# EAGLE design AS3364 DG412 bus mixer v1.4 (EAGLE 9.6.2)
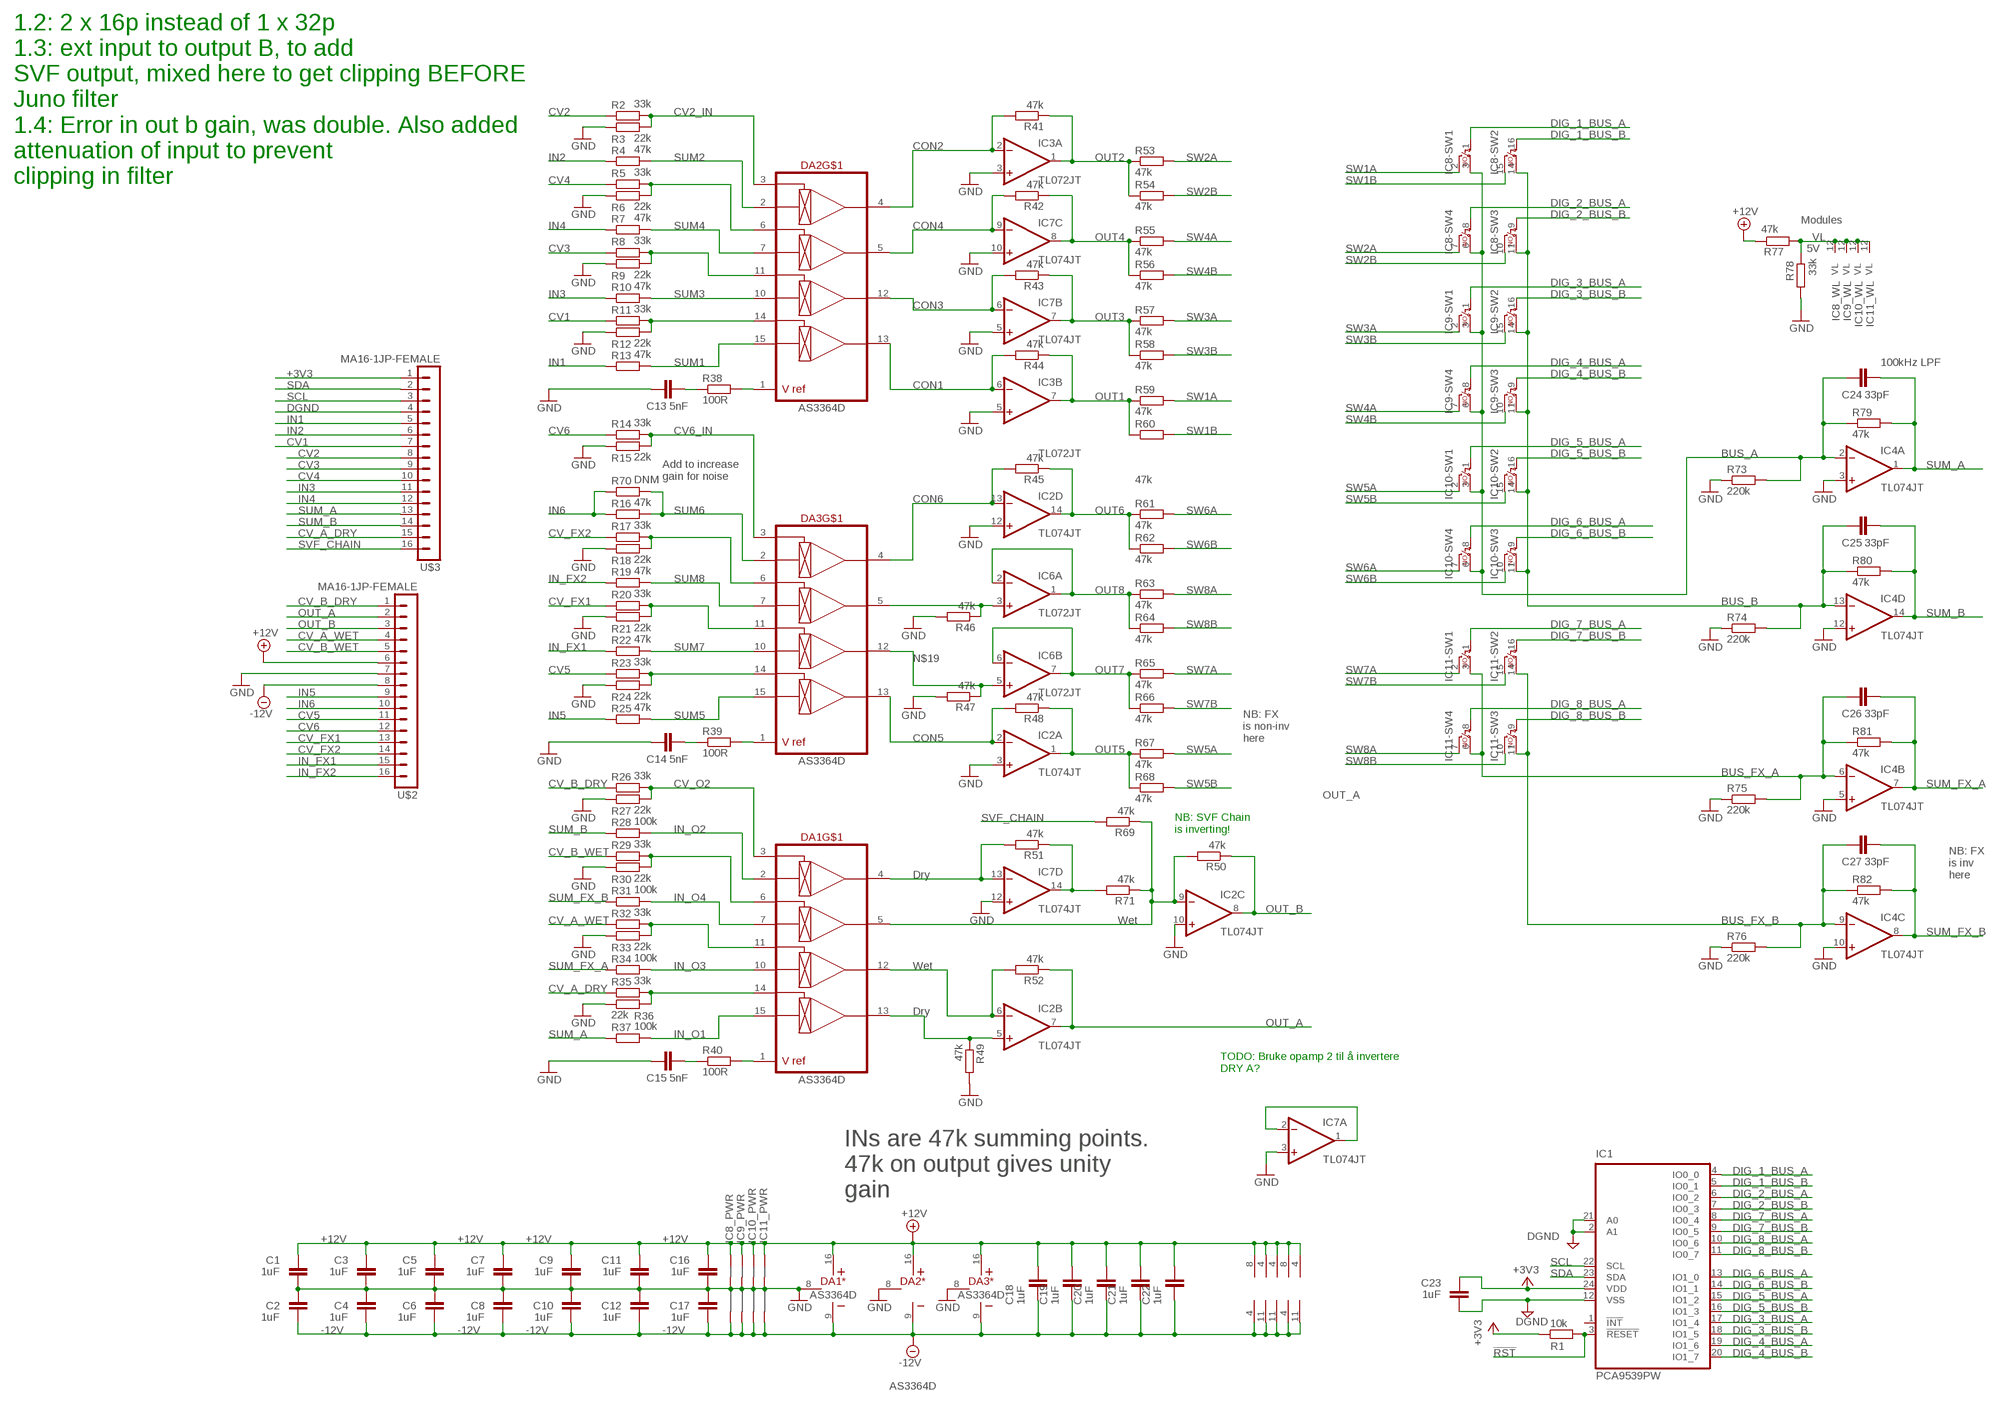
[diagram p0: schematic, sheet 1]

## Parts
C1  1uF  C-EU-J0402  [C0402-J]
C2  1uF  C-EU-J0402  [C0402-J]
C3  1uF  C-EU-J0402  [C0402-J]
C4  1uF  C-EU-J0402  [C0402-J]
C5  1uF  C-EU-J0402  [C0402-J]
C6  1uF  C-EU-J0402  [C0402-J]
C7  1uF  C-EU-J0402  [C0402-J]
C8  1uF  C-EU-J0402  [C0402-J]
C9  1uF  C-EU-J0402  [C0402-J]
C10  1uF  C-EU-J0402  [C0402-J]
C11  1uF  C-EU-J0402  [C0402-J]
C12  1uF  C-EU-J0402  [C0402-J]
C13  5nF  C-EU-J0402  [C0402-J]
C14  5nF  C-EU-J0402  [C0402-J]
C15  5nF  C-EU-J0402  [C0402-J]
C16  1uF  C-EU-J0402  [C0402-J]
C17  1uF  C-EU-J0402  [C0402-J]
C18  1uF  C-EUC0402  [C0402]
C19  1uF  C-EUC0402  [C0402]
C20  1uF  C-EUC0402  [C0402]
C21  1uF  C-EUC0402  [C0402]
C22  1uF  C-EUC0402  [C0402]
C23  1uF  C-EUC0402  [C0402]
C24  33pF  C-EU-J0402  [C0402-J]
C25  33pF  C-EU-J0402  [C0402-J]
C26  33pF  C-EU-J0402  [C0402-J]
C27  33pF  C-EU-J0402  [C0402-J]
DA1  AS3364D  [DIL16J]
DA2  AS3364D  [DIL16J]
DA3  AS3364D  [DIL16J]
IC1  PCA9539PW  [TSSOP24J]
IC2  TL074JT  [TSSOP14J]
IC3  TL072JT  [TSSOP8J]
IC4  TL074JT  [TSSOP14J]
IC6  TL072JT  [TSSOP8J]
IC7  TL074JT  [TSSOP14J]
IC8  DG412-J  [DIL16J]
IC9  DG412-J  [DIL16J]
IC10  DG412-J  [DIL16J]
IC11  DG412-J  [DIL16J]
R1  10k  R-EU_R0402  [R0402]
R2  33k  R-EU_R0402  [R0402]
R3  22k  R-EU_R0402  [R0402]
R4  47k  R-EU_R0402  [R0402]
R5  33k  R-EU_R0402  [R0402]
R6  22k  R-EU_R0402  [R0402]
R7  47k  R-EU_R0402  [R0402]
R8  33k  R-EU_R0402  [R0402]
R9  22k  R-EU_R0402  [R0402]
R10  47k  R-EU_R0402  [R0402]
R11  33k  R-EU_R0402  [R0402]
R12  22k  R-EU_R0402  [R0402]
R13  47k  R-EU_R0402  [R0402]
R14  33k  R-EU_R0402  [R0402]
R15  22k  R-EU_R0402  [R0402]
R16  47k  R-EU_R0402  [R0402]
R17  33k  R-EU_R0402  [R0402]
R18  22k  R-EU_R0402  [R0402]
R19  47k  R-EU_R0402  [R0402]
R20  33k  R-EU_R0402  [R0402]
R21  22k  R-EU_R0402  [R0402]
R22  47k  R-EU_R0402  [R0402]
R23  33k  R-EU_R0402  [R0402]
R24  22k  R-EU_R0402  [R0402]
R25  47k  R-EU_R0402  [R0402]
R26  33k  R-EU_R0402  [R0402]
R27  22k  R-EU_R0402  [R0402]
R28  100k  R-EU_R0402  [R0402]
R29  33k  R-EU_R0402  [R0402]
R30  22k  R-EU_R0402  [R0402]
R31  100k  R-EU_R0402  [R0402]
R32  33k  R-EU_R0402  [R0402]
R33  22k  R-EU_R0402  [R0402]
R34  100k  R-EU_R0402  [R0402]
R35  33k  R-EU_R0402  [R0402]
R36  22k  R-EU_R0402  [R0402]
R37  100k  R-EU_R0402  [R0402]
R38  100R  R-EU_R0402  [R0402]
R39  100R  R-EU_R0402  [R0402]
R40  100R  R-EU_R0402  [R0402]
R41  47k  R-EU_R0402  [R0402]
R42  47k  R-EU_R0402  [R0402]
R43  47k  R-EU_R0402  [R0402]
R44  47k  R-EU_R0402  [R0402]
R45  47k  R-EU_R0402  [R0402]
R46  47k  R-EU_R0402  [R0402]
R47  47k  R-EU_R0402  [R0402]
R48  47k  R-EU_R0402  [R0402]
R49  47k  R-EU_R0402  [R0402]
R50  47k  R-EU_R0402  [R0402]
R51  47k  R-EU_R0402  [R0402]
R52  47k  R-EU_R0402  [R0402]
R53  47k  R-EU_R0402  [R0402]
R54  47k  R-EU_R0402  [R0402]
R55  47k  R-EU_R0402  [R0402]
R56  47k  R-EU_R0402  [R0402]
R57  47k  R-EU_R0402  [R0402]
R58  47k  R-EU_R0402  [R0402]
R59  47k  R-EU_R0402  [R0402]
R60  47k  R-EU_R0402  [R0402]
R61  47k  R-EU_R0402  [R0402]
R62  47k  R-EU_R0402  [R0402]
R63  47k  R-EU_R0402  [R0402]
R64  47k  R-EU_R0402  [R0402]
R65  47k  R-EU_R0402  [R0402]
R66  47k  R-EU_R0402  [R0402]
R67  47k  R-EU_R0402  [R0402]
R68  47k  R-EU_R0402  [R0402]
R69  47k  R-EU_R0402  [R0402]
R70  DNM  R-EU_R0805  [R0805]
R71  47k  R-EU_R0402  [R0402]
R73  220k  R-EU_R0603  [R0603]
R74  220k  R-EU_R0603  [R0603]
R75  220k  R-EU_R0603  [R0603]
R76  220k  R-EU_R0603  [R0603]
R77  47k  R-EU_R0402  [R0402]
R78  33k  R-EU_R0402  [R0402]
R79  47k  R-EU_R0402  [R0402]
R80  47k  R-EU_R0402  [R0402]
R81  47k  R-EU_R0402  [R0402]
R82  47k  R-EU_R0402  [R0402]
U$2  MA16-1JP-FEMALE  MA16-1JP  [SIP-PIN16-1J]
U$3  MA16-1JP-FEMALE  MA16-1JP  [SIP-PIN16-1J]

## Nets
!RST: IC1.3(!RESET) R1.2
+3V3: C23.2 IC1.24(VDD) R1.1 U$3.1
+12V: C1.2 C3.2 C5.2 C7.2 C9.2 C11.2 C16.2 C18.2 C19.2 C20.2 C21.2 C22.2 DA1.16(*:V+) DA2.16(*:V+) DA3.16(*:V+) IC2.4(P:V+) IC3.8(P:V+) IC4.4(P:V+) IC6.8(P:V+) IC7.4(P:V+) IC8.13(_PWR:+15V) IC9.13(_PWR:+15V) IC10.13(_PWR:+15V) IC11.13(_PWR:+15V) R77.1 U$2.6
-12V: C2.1 C4.1 C6.1 C8.1 C10.1 C12.1 C17.1 C18.1 C19.1 C20.1 C21.1 C22.1 DA1.9(*:V-) DA2.9(*:V-) DA3.9(*:V-) IC2.11(P:V-) IC3.4(P:V-) IC4.11(P:V-) IC6.4(P:V-) IC7.11(P:V-) IC8.4(_PWR:-15V) IC9.4(_PWR:-15V) IC10.4(_PWR:-15V) IC11.4(_PWR:-15V) U$2.8
BUS_A: C24.1 IC4.2(A:-IN) IC8.3(-SW1:S) IC8.6(-SW4:S) IC9.3(-SW1:S) IC9.6(-SW4:S) IC10.3(-SW1:S) IC10.6(-SW4:S) R73.2 R79.1
BUS_B: C25.1 IC4.13(D:-IN) IC8.11(-SW3:S) IC8.14(-SW2:S) IC9.11(-SW3:S) IC9.14(-SW2:S) IC10.11(-SW3:S) IC10.14(-SW2:S) R74.2 R80.1
BUS_FX_A: C26.1 IC4.6(B:-IN) IC11.3(-SW1:S) IC11.6(-SW4:S) R75.2 R81.1
BUS_FX_B: C27.1 IC4.9(C:-IN) IC11.11(-SW3:S) IC11.14(-SW2:S) R76.2 R82.1
CON1: DA2.13(OUT4) IC3.6(B:-IN) R44.2
CON2: DA2.4(OUT1) IC3.2(A:-IN) R41.2
CON3: DA2.12(OUT3) IC7.6(B:-IN) R43.2
CON4: DA2.5(OUT2) IC7.9(C:-IN) R42.2
CON5: DA3.13(OUT4) IC2.2(A:-IN) R48.2
CON6: DA3.4(OUT1) IC2.13(D:-IN) R45.2
CON_O1: DA1.12(OUT3) IC2.6(B:-IN) R52.2
CV1: R11.1 U$3.7
CV2: R2.1 U$3.8
CV2_IN: DA2.3(CV1) R2.2 R3.2
CV3: R8.1 U$3.9
CV4: R5.1 U$3.10
CV5: R23.1 U$2.11
CV6: R14.1 U$2.12
CV6_IN: DA3.3(CV1) R14.2 R15.2
CV_A_DRY: R35.1 U$3.15
CV_A_WET: R32.1 U$2.4
CV_B_DRY: R26.1 U$2.1
CV_B_WET: R29.1 U$2.5
CV_FX1: R20.1 U$2.13
CV_FX2: R17.1 U$2.14
CV_O2: DA1.3(CV1) R26.2 R27.2
DGND: C23.1 IC1.2(A1) IC1.12(VSS) IC1.21(A0) U$3.4
DIG_1_BUS_A: IC1.4(IO0_0) IC8.1(-SW1:C)
DIG_1_BUS_B: IC1.5(IO0_1) IC8.16(-SW2:C)
DIG_2_BUS_A: IC1.6(IO0_2) IC8.8(-SW4:C)
DIG_2_BUS_B: IC1.7(IO0_3) IC8.9(-SW3:C)
DIG_3_BUS_A: IC1.17(IO1_4) IC9.1(-SW1:C)
DIG_3_BUS_B: IC1.18(IO1_5) IC9.16(-SW2:C)
DIG_4_BUS_A: IC1.19(IO1_6) IC9.8(-SW4:C)
DIG_4_BUS_B: IC1.20(IO1_7) IC9.9(-SW3:C)
DIG_5_BUS_A: IC1.15(IO1_2) IC10.1(-SW1:C)
DIG_5_BUS_B: IC1.16(IO1_3) IC10.16(-SW2:C)
DIG_6_BUS_A: IC1.13(IO1_0) IC10.8(-SW4:C)
DIG_6_BUS_B: IC1.14(IO1_1) IC10.9(-SW3:C)
DIG_7_BUS_A: IC1.8(IO0_4) IC11.1(-SW1:C)
DIG_7_BUS_B: IC1.9(IO0_5) IC11.16(-SW2:C)
DIG_8_BUS_A: IC1.10(IO0_6) IC11.8(-SW4:C)
DIG_8_BUS_B: IC1.11(IO0_7) IC11.9(-SW3:C)
GND: C1.1 C2.2 C3.1 C4.2 C5.1 C6.2 C7.1 C8.2 C9.1 C10.2 C11.1 C12.2 C13.1 C14.1 C15.1 C16.1 C17.2 DA1.8(*:GND) DA2.8(*:GND) DA3.8(*:GND) IC2.3(A:+IN) IC2.10(C:+IN) IC2.12(D:+IN) IC3.3(A:+IN) IC3.5(B:+IN) IC4.3(A:+IN) IC4.5(B:+IN) IC4.10(C:+IN) IC4.12(D:+IN) IC7.3(A:+IN) IC7.5(B:+IN) IC7.10(C:+IN) IC7.12(D:+IN) IC8.5(_PWR:AGND) IC9.5(_PWR:AGND) IC10.5(_PWR:AGND) IC11.5(_PWR:AGND) R3.1 R6.1 R9.1 R12.1 R15.1 R18.1 R21.1 R24.1 R27.1 R30.1 R33.1 R36.1 R46.2 R47.2 R49.2 R73.1 R74.1 R75.1 R76.1 R78.2 U$2.7
IN1: R13.1 U$3.5
IN2: R4.1 U$3.6
IN3: R10.1 U$3.11
IN4: R7.1 U$3.12
IN5: R25.1 U$2.9
IN6: R16.1 R70.1 U$2.10
IN_FX1: R22.1 U$2.15
IN_FX2: R19.1 U$2.16
IN_O1: DA1.15(IN4) R37.2
IN_O2: DA1.2(IN1) R28.2
IN_O3: DA1.10(IN3) R34.2
IN_O4: DA1.7(IN2) R31.2
N$1: DA3.1(VREF) R39.2
N$2: DA2.1(VREF) R38.2
N$3: DA3.6(CV2) R17.2 R18.2
N$4: DA3.5(OUT2) IC6.3(A:+IN) R46.1
N$5: DA3.11(CV3) R20.2 R21.2
N$6: DA1.5(OUT2) IC2.9(C:-IN) R50.2 R69.1 R71.1
N$7: DA3.14(CV4) R23.2 R24.2
N$8: C14.2 R39.1
N$9: DA1.1(VREF) R40.2
N$10: DA2.6(CV2) R5.2 R6.2
N$11: DA1.6(CV2) R29.2 R30.2
N$12: DA2.11(CV3) R8.2 R9.2
N$13: DA1.11(CV3) R32.2 R33.2
N$14: C13.2 R38.1
N$15: DA1.14(CV4) R35.2 R36.2
N$16: C15.2 R40.1
N$17: DA1.4(OUT1) IC7.13(D:-IN) R51.2
N$18: DA1.13(OUT4) IC2.5(B:+IN) R49.1
N$19: DA3.12(OUT3) IC6.5(B:+IN) R47.1
N$20: IC7.14(D:OUT) R51.1 R71.2
N$21: DA2.14(CV4) R11.2 R12.2
N$22: IC7.1(A:OUT) IC7.2(A:-IN)
OUT1: IC3.7(B:OUT) R44.1 R59.1 R60.1
OUT2: IC3.1(A:OUT) R41.1 R53.1 R54.1
OUT3: IC7.7(B:OUT) R43.1 R57.1 R58.1
OUT4: IC7.8(C:OUT) R42.1 R55.1 R56.1
OUT5: IC2.1(A:OUT) R48.1 R67.1 R68.1
OUT6: IC2.14(D:OUT) R45.1 R61.1 R62.1
OUT7: IC6.6(B:-IN) IC6.7(B:OUT) R65.1 R66.1
OUT8: IC6.1(A:OUT) IC6.2(A:-IN) R63.1 R64.1
OUT_A: IC2.7(B:OUT) R52.1 U$2.2
OUT_B: IC2.8(C:OUT) R50.1 U$2.3
SCL: IC1.22(SCL) U$3.3
SDA: IC1.23(SDA) U$3.2
SUM1: DA2.15(IN4) R13.2
SUM2: DA2.2(IN1) R4.2
SUM3: DA2.10(IN3) R10.2
SUM4: DA2.7(IN2) R7.2
SUM5: DA3.15(IN4) R25.2
SUM6: DA3.2(IN1) R16.2 R70.2
SUM7: DA3.10(IN3) R22.2
SUM8: DA3.7(IN2) R19.2
SUM_A: C24.2 IC4.1(A:OUT) R37.1 R79.2 U$3.13
SUM_B: C25.2 IC4.14(D:OUT) R28.1 R80.2 U$3.14
SUM_FX_A: C26.2 IC4.7(B:OUT) R34.1 R81.2
SUM_FX_B: C27.2 IC4.8(C:OUT) R31.1 R82.2
SVF_CHAIN: R69.2 U$3.16
SW1A: IC8.2(-SW1:D) R59.2
SW1B: IC8.15(-SW2:D) R60.2
SW2A: IC8.7(-SW4:D) R53.2
SW2B: IC8.10(-SW3:D) R54.2
SW3A: IC9.2(-SW1:D) R57.2
SW3B: IC9.15(-SW2:D) R58.2
SW4A: IC9.7(-SW4:D) R55.2
SW4B: IC9.10(-SW3:D) R56.2
SW5A: IC10.2(-SW1:D) R67.2
SW5B: IC10.15(-SW2:D) R68.2
SW6A: IC10.7(-SW4:D) R61.2
SW6B: IC10.10(-SW3:D) R62.2
SW7A: IC11.2(-SW1:D) R65.2
SW7B: IC11.15(-SW2:D) R66.2
SW8A: IC11.7(-SW4:D) R63.2
SW8B: IC11.10(-SW3:D) R64.2
VL: IC8.12(_WL:VL) IC9.12(_WL:VL) IC10.12(_WL:VL) IC11.12(_WL:VL) R77.2 R78.1
Unconnected: IC1.1(!INT)

## Notes on the sheet
- 1.2: 2 x 16p instead of 1 x 32p
  1.3: ext input to output B, to add
  SVF output, mixed here to get clipping BEFORE
  Juno filter
  1.4: Error in out b gain, was double. Also added 
  attenuation of input to prevent 
  clipping in filter
- Modules
- 5V
- 100kHz LPF
- Add to increase
  gain for noise
- NB: FX
  is non-inv
  here
- NB: SVF Chain
  is inverting!
- Dry
- NB: FX
  is inv
  here
- Wet
- Wet
- Dry
- TODO: Bruke opamp 2 til å invertere
  DRY A?
- INs are 47k summing points.
  47k on output gives unity
  gain

## Library data of the parts
C1-C17 C24-C27 = joakim:C-EU-J: CAPACITOR, European symbol
C18-C23 = rcl:C-EU: CAPACITOR, European symbol; SPICEPREFIX: C
DA1-DA3 = joakim:AS3364: AS3364 quad linear VCA, CEM3360 style. CV is 0 to 2V Vcc-Vee = 26V max, so +/-12V or +15V/-9V
IC1 = joakim:PCA9539: 16ch i/o expander. RPW version resets only internal statemachine to get out of stuck i2c-bus, other versions also reset outputs. Interrupt output requires external pull-up resistor for all variants. https://www.nxp.com/docs/en/data-sheet/PCA9539_PCA9539R.pdf
IC2 IC4 IC7 = joakim:TL074J: OP AMP
IC3 IC6 = joakim:TL072J: OP AMP
IC8-IC11 = joakim:DG412-J: Quad switch, normally open
R1-R71 R73-R82 = rcl:R-EU_: RESISTOR, European symbol; SPICEPREFIX: R
U$2 U$3 = joakim:MA16-1J

## Board
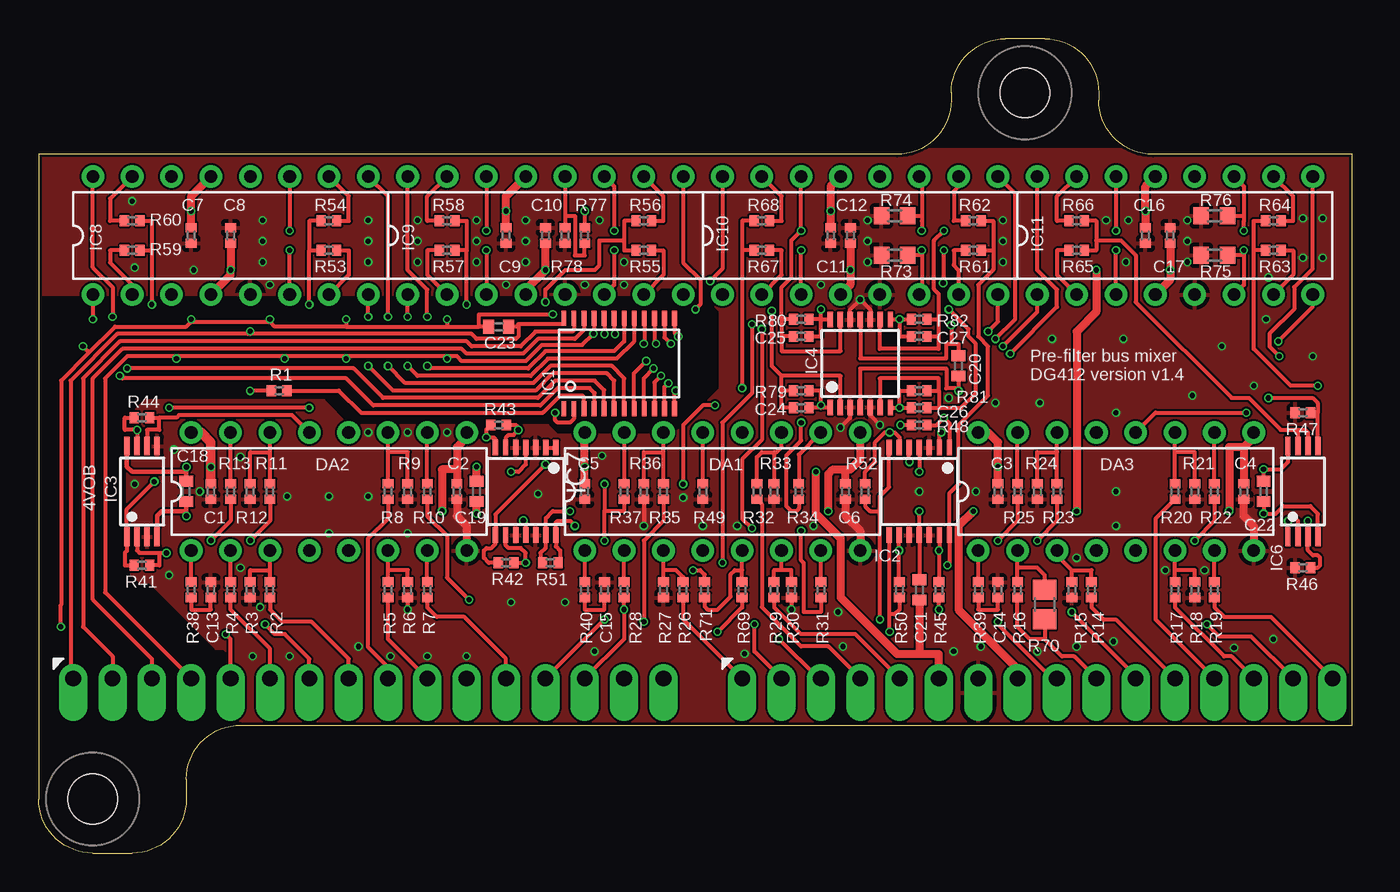
[diagram p1: board, top side]
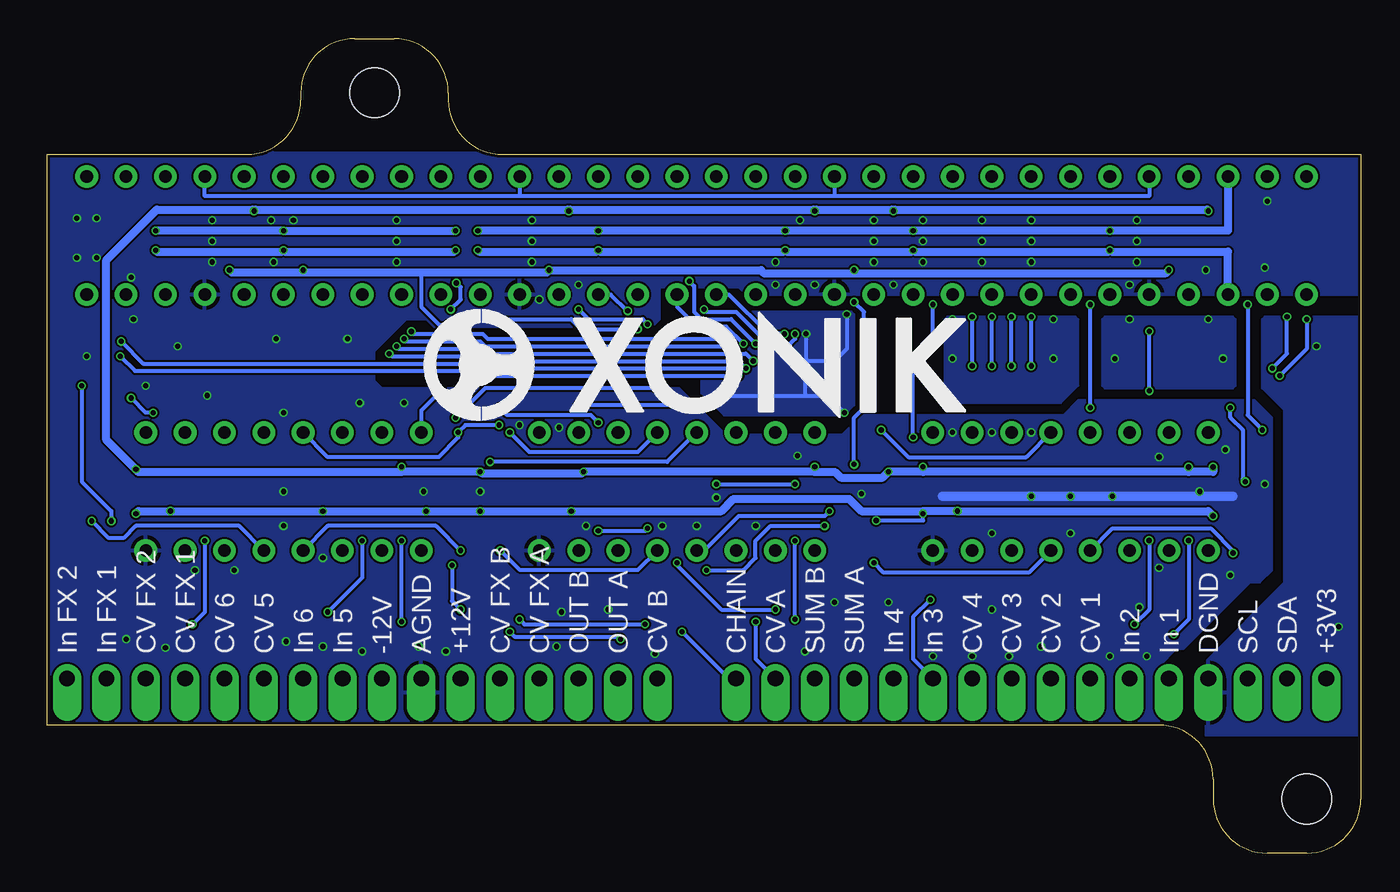
[diagram p2: board, bottom side, seen from below]

Size 84.77 x 52.55 mm. Coordinates in mm from the lower left corner, seen from the top.
Outline: 3.49,0 6.03,0 arc90 9.52,3.49 9.52,4.76 arc-90 13.02,8.26 84.77,8.26 84.77,45.09 71.91,45.09 arc-90 68.42,48.58 68.42,49.05 arc90 64.93,52.55 62.39,52.55 arc90 58.9,49.05 58.9,48.58 arc-90 55.4,45.09 0,45.09 0,3.49 arc90 3.49,0
Copper layers (1*16): Top 0.035mm / dielectric 1.6mm / Bottom 0.035mm
Design rules "jlcpcb-2layers *": minimum track width 5mil, minimum drill 0.3mm, track to track 5mil, track to pad 5mil, pad to pad 5mil, via to via 5mil, smd to smd 5mil, copper to edge 0.2mm, drill to drill 6mil, minimum pad ring 10mil, minimum via ring 4mil, stop-mask expansion 4mil, vias tented up to drill 0mil, thermal gap 10mil
Holes 3.2 mm at 63.66,49.05 3.49,3.49

### Footprints (pad centres in the part's own frame; a part is rotated, then mirrored left to right if it is on the bottom)
C0402-J = smd 0.6 x 0.7: 1 -0.5,0; 2 0.5,0
C0402 = smd 0.7 x 0.9: 1 -0.65,0; 2 0.65,0
DIL16J = drill 0.813: 1 -8.89,-3.81; 2 -6.35,-3.81; 3 -3.81,-3.81; 4 -1.27,-3.81; 5 1.27,-3.81; 6 3.81,-3.81; 7 6.35,-3.81; 8 8.89,-3.81; 9 8.89,3.81; 10 6.35,3.81; 11 3.81,3.81; 12 1.27,3.81; 13 -1.27,3.81; 14 -3.81,3.81; 15 -6.35,3.81; 16 -8.89,3.81
TSSOP24J = smd 0.305 x 0.991: 1 -3.575,-2.918; 2 -2.925,-2.918; 3 -2.275,-2.918; 4 -1.625,-2.918; 5 -0.975,-2.918; 6 -0.325,-2.918; 7 0.325,-2.918; 8 0.975,-2.918; 9 1.625,-2.918; 10 2.275,-2.918; 11 2.925,-2.918; 12 3.575,-2.918; 13 3.575,2.918; 14 2.925,2.918; 15 2.275,2.918; 16 1.625,2.918; 17 0.975,2.918; 18 0.325,2.918; 19 -0.325,2.918; 20 -0.975,2.918; 21 -1.625,2.918; 22 -2.275,2.918; 23 -2.925,2.918; 24 -3.575,2.918
TSSOP14J = smd 0.35 x 1: 1 -1.95,-2.825; 2 -1.3,-2.825; 3 -0.65,-2.825; 4 0,-2.825; 5 0.65,-2.825; 6 1.3,-2.825; 7 1.95,-2.825; 8 1.95,2.825; 9 1.3,2.825; 10 0.65,2.825; 11 0,2.825; 12 -0.65,2.825; 13 -1.3,2.825; 14 -1.95,2.825
TSSOP8J = smd 1.2 x 0.35: 1 -2.925,0.975; 2 -2.925,0.325; 3 -2.925,-0.325; 4 -2.925,-0.975; 5 2.925,-0.975; 6 2.925,-0.325; 7 2.925,0.325; 8 2.925,0.975
R0402 = smd 0.6 x 0.7: 1 -0.5,0; 2 0.5,0
R0805 = smd 1.3 x 1.5: 1 -0.95,0; 2 0.95,0
R0603 = smd 1 x 1.1: 1 -0.85,0; 2 0.85,0
SIP-PIN16-1J = drill 1.016 offset: 1 -19.05,0; 2 -16.51,0; 3 -13.97,0; 4 -11.43,0; 5 -8.89,0; 6 -6.35,0; 7 -3.81,0; 8 -1.27,0; 9 1.27,0; 10 3.81,0; 11 6.35,0; 12 8.89,0; 13 11.43,0; 14 13.97,0; 15 16.51,0; 16 19.05,0

### Placement (x,y rotation side)
C1  11.11,23.34 90 top
C2  26.99,23.34 270 top
C3  61.91,23.34 90 top
C4  77.79,23.34 270 top
C5  35.24,23.34 90 top
C6  52.07,23.34 270 top
C7  9.84,39.85 90 top
C8  12.38,39.85 90 top
C9  30.16,39.85 90 top
C10  32.7,39.85 90 top
C11  51.12,39.85 90 top
C12  52.39,39.85 90 top
C13  11.11,16.99 270 top
C14  61.91,16.99 270 top
C15  36.51,16.99 270 top
C16  71.44,39.85 90 top
C17  73.03,39.85 90 top
C18  9.53,23.34 90 top
C19  28.26,23.34 90 top
C20  59.37,31.43 270 top
C21  56.83,16.99 270 top
C22  79.06,23.34 90 top
C23  29.69,33.97 0 top
C24  49.21,29.84 0 top
C25  49.21,33.34 0 top
C26  56.83,29.84 180 top
C27  56.83,33.34 180 top
DA1  44.13,23.34 0 top
DA2  18.73,23.34 0 top
DA3  69.53,23.34 0 top
IC1  37.47,31.59 0 top
IC2  56.83,23.34 180 top
IC3  6.67,23.34 90 top
IC4  53.02,31.59 0 top
IC6  81.6,23.34 90 top
IC7  31.43,23.34 180 top
IC8  12.38,39.85 0 top
IC9  32.7,39.85 0 top
IC10  53.02,39.85 0 top
IC11  73.34,39.85 0 top
R1  15.53,29.84 0 top
R2  14.92,16.99 90 top
R3  13.65,16.99 90 top
R4  12.38,16.99 90 top
R5  22.54,16.99 90 top
R6  23.81,16.99 90 top
R7  25.08,16.99 90 top
R8  22.54,23.34 90 top
R9  23.81,23.34 90 top
R10  25.08,23.34 90 top
R11  14.92,23.34 90 top
R12  13.65,23.34 90 top
R13  12.38,23.34 90 top
R14  67.95,16.99 90 top
R15  66.67,16.99 90 top
R16  63.18,16.99 90 top
R17  73.34,16.99 90 top
R18  74.61,16.99 90 top
R19  75.88,16.99 90 top
R20  73.34,23.34 90 top
R21  74.61,23.34 90 top
R22  75.88,23.34 90 top
R23  65.72,23.34 90 top
R24  64.45,23.34 90 top
R25  63.18,23.34 90 top
R26  41.59,16.99 90 top
R27  40.32,16.99 90 top
R28  37.78,16.99 90 top
R29  47.47,16.99 90 top
R30  48.58,16.99 90 top
R31  50.48,16.99 90 top
R32  46.36,23.34 90 top
R33  47.47,23.34 90 top
R34  49.05,23.34 90 top
R35  40.32,23.34 90 top
R36  39.05,23.34 90 top
R37  37.78,23.34 90 top
R38  9.84,16.99 90 top
R39  60.64,16.99 90 top
R40  35.24,16.99 90 top
R41  6.67,18.57 0 top
R42  30.16,18.73 0 top
R43  29.69,27.62 0 top
R44  6.67,28.1 0 top
R45  58.1,16.99 90 top
R46  81.6,18.41 180 top
R47  81.6,28.42 180 top
R48  56.83,27.62 180 top
R49  42.86,23.34 270 top
R50  55.56,16.99 90 top
R51  33.02,18.73 180 top
R52  53.34,23.34 90 top
R53  18.73,38.89 0 top
R54  18.73,40.8 0 top
R55  39.05,38.89 0 top
R56  39.05,40.8 0 top
R57  26.35,38.89 180 top
R58  26.35,40.8 180 top
R59  6.03,38.89 180 top
R60  6.03,40.8 180 top
R61  60.33,38.89 180 top
R62  60.33,40.8 180 top
R63  79.69,38.89 0 top
R64  79.69,40.8 0 top
R65  66.99,38.89 180 top
R66  66.99,40.8 180 top
R67  46.67,38.89 0 top
R68  46.67,40.8 0 top
R69  45.4,16.99 270 top
R70  64.93,16.03 90 top
R71  42.98,16.99 90 top
R73  55.24,38.58 0 top
R74  55.24,41.12 0 top
R75  75.88,38.58 0 top
R76  75.88,41.12 0 top
R77  35.24,39.85 270 top
R78  33.97,39.85 270 top
R79  49.21,28.73 0 top
R80  49.21,34.45 0 top
R81  56.83,28.73 180 top
R82  56.83,34.45 180 top
U$1  [XONIK_LOGO_35]  60.48,27.94 0 bottom
U$2  64.45,11.27 0 top
U$3  21.27,11.27 0 top

### Tracks (layer width: path | path; a pad name or v marks a point on that pad's centre or on a via)
!RST
  Top 0.254: IC1.3 35.19,29.42 35.08,29.53 33.66,29.53 32.54,28.42 20.8,28.42 19.37,29.84 R1.2
+3V3  (via drill 0.33)
  Top 0.254: IC1.24 33.89,34.19 33.83,34.13 30.96,34.13 30.96,33.97 | 30.96,33.97 C23.2 | 30.96,33.97 30.96,33.34 30.8,33.18 28.26,33.18 27.94,33.5 13.65,33.5 | 13.65,33.5 13.49,33.5 5.08,33.5 2.06,30.48 2.06,11.43 U$3.1 | 13.65,33.5 13.65,33.66 13.63,33.66 v13.65,33.67 | R1.1 13.67,29.84 v13.65,29.83
  Bottom 0.254: v13.65,29.83 v13.65,33.67
+12V  (via drill 0.33, 0.35)
  Top 0.254: v35.24,41.43 R77.1 | IC4.4 53.02,31.27 58.56,31.27 58.58,31.26 58.58,29.98 59.21,29.98 v59.37,29.83 C20.2 | C22.2 v79.06,24.77 80.17,24.77 80.64,25.24 80.64,26.24 IC6.8 | IC2.4 v56.83,24.61 | C20.2 | 30.46,24.63 v30.48,24.61 30.96,24.61 31.43,25.08 IC7.4
  Top 0.305: IC3.8 5.69,24.95 6.03,24.61 9.52,24.61 | 9.52,24.61 C18.2 | 9.52,24.61 v9.52,24.92
  Top 0.508: C3.2 v61.91,24.92 61.91,26.51 61.28,27.15 DA3.16 | C5.2 v35.24,24.92 DA1.16 | C7.2 v9.84,41.43 9.84,42.39 IC8.13 | C9.2 v30.16,41.43 30.16,42.39 IC9.13 | C11.2 v51.12,41.43 51.12,43.02 IC10.13 | C16.2 v71.44,41.43 71.44,43.02 IC11.13 | C19.2 v28.26,24.92 | U$2.6 58.1,12.86 56.83,12.86 | v50.16,24.61 50.16,21.91 51.75,20.32 51.75,16.51 55.4,12.86 56.83,12.86 | C21.2 56.83,12.86
  Top 0.61: C1.2 v11.11,24.92 11.11,26.51 10.48,27.15 DA2.16
  Bottom 0.254: v59.37,29.83 60.64,28.55 DA3.16
  Bottom 0.508: 35.24,24.61 v50.16,24.61 50.24,24.53 56.75,24.53 v56.83,24.61 61.91,24.61 | v9.52,24.92 9.52,24.61 11.11,24.61 | v9.84,41.43 9.92,41.51 30.08,41.51 v30.16,41.43 30.24,41.51 35.16,41.51 v35.24,41.43 35.32,41.51 51.04,41.51 v51.12,41.43 51.2,41.51 71.36,41.51 v71.44,41.43 71.52,41.51 77.71,41.51 80.96,38.26 80.96,26.67 v79.06,24.77 78.9,24.61 61.91,24.61 | v35.24,24.92 35.24,24.61 | v61.91,24.92 61.91,24.61 | 11.11,24.61 28.26,24.61 | 28.26,24.61 v30.48,24.61 30.86,24.22 33.56,24.22 33.94,24.61 35.24,24.61 | v11.11,24.92 11.11,24.61 | v28.26,24.92 28.26,24.61
-12V  (via drill 0.33, 0.35)
  Top 0.254: v56.83,22.07 IC2.11 C21.1 | IC4.11 53.02,31.91 58.58,31.91 58.58,32.86 58.9,32.86 | C22.1 v79.06,21.91 79.85,21.91 80.33,22.38 82.07,22.38 82.57,21.89 IC6.4 | 58.9,32.86 59.37,32.86 C20.1 | v58.9,34.07 58.9,32.86 | 31.46,21.28 v31.27,21.46 31.43,21.3 IC7.11
  Top 0.305: IC3.4 7.64,21.77 7.94,22.07 9.52,22.07 | 9.52,22.07 C18.1 | 9.52,22.07 v9.52,21.75
  Top 0.508: DA2.9 27.62,26.83 26.99,26.19 26.99,24.77 | 26.99,24.77 C2.1 | 26.99,24.77 26.03,24.77 v26.03,22.07 | DA3.9 78.42,26.83 77.79,26.19 | 77.79,26.19 C4.1 | 77.79,26.19 76.83,26.19 v76.83,22.07 | C6.1 52.07,24.77 | C8.1 v12.38,37.62 12.38,37.31 IC8.4 | IC9.4 31.43,36.35 v32.7,37.62 C10.1 | C12.1 v52.39,37.62 52.39,36.67 IC10.4 | C17.1 v73.03,37.62 73.03,36.99 IC11.4 | v68.26,37.62 68.26,34.93 66.99,33.66 v66.99,22.07 | U$2.8 63.18,11.91 59.37,15.72 59.37,21.11 v60.33,22.07 | 52.07,24.77 52.39,24.77 53.02,25.4 DA1.9 | v28.26,21.91 C19.1 | v50.96,22.07 50.96,24.45 51.28,24.77 52.07,24.77
  Bottom 0.254: v58.9,34.07 59.45,34.07 60.64,35.26 60.64,37.47 | v68.26,37.62 68.42,37.47 68.74,37.47 | v31.27,21.46 28.26,21.46 28.26,22.07
  Bottom 0.508: v9.52,21.75 9.84,22.07 v26.03,22.07 28.26,22.07 | 28.26,22.07 32.23,22.07 33.02,22.86 40.48,22.86 41.27,22.07 v50.96,22.07 v56.83,22.07 v60.33,22.07 v66.99,22.07 v76.83,22.07 78.9,22.07 v79.06,21.91 | 32.7,37.43 12.58,37.43 v12.38,37.62 | 32.7,37.43 38.54,37.43 38.7,37.58 38.7,37.62 v52.39,37.62 52.55,37.47 60.64,37.47 68.74,37.47 72.87,37.47 v73.03,37.62 | 32.7,37.43 v32.7,37.62 | 28.26,22.07 v28.26,21.91
BUS_A  (via drill 0.33)
  Top 0.254: v28.89,38.89 IC9.3 | v37.15,38.89 37.15,36.67 IC9.6 | IC8.6 v16.19,38.89 | IC10.3 v49.21,38.89 | IC10.6 56.99,36.2 v56.99,38.89 56.99,38.58 R73.2 | IC4.2 51.75,28.8 51.75,30.8 47.94,30.8 | v47.31,34.98 47.31,31.43 47.94,30.8 | R79.1 47.94,28.73 47.94,29.84 | 47.94,29.84 47.94,30.8 | C24.1 47.94,29.84
  Bottom 0.254: IC10.3 48.42,36.04 47.37,34.98 v47.31,34.98
  Bottom 0.508: IC8.3 8.57,38.81 16.11,38.81 v16.19,38.89 16.27,38.81 28.81,38.81 v28.89,38.89 28.97,38.81 37.07,38.81 v37.15,38.89 37.23,38.81 49.13,38.81 v49.21,38.89 49.29,38.81 56.91,38.81 v56.99,38.89
BUS_B  (via drill 0.33)
  Top 0.254: IC8.11 v16.19,40.16 | IC9.14 v28.89,40.16 | IC9.11 37.15,43.02 v37.15,40.16 | IC10.14 v49.21,40.16 48.58,39.53 48.58,37.15 47.94,36.51 47.94,34.45 | v56.99,40.16 56.99,40.8 56.99,41.12 | R74.2 56.99,41.12 | 47.94,34.45 47.94,33.34 | 47.94,33.34 47.94,32.38 51.75,32.38 51.75,34.39 IC4.13 | R80.1 47.94,34.45 | IC10.11 56.99,43.5 56.99,41.12 | C25.1 47.94,33.34
  Bottom 0.508: IC8.14 8.57,40.16 v16.19,40.16 v28.89,40.16 v37.15,40.16 v49.21,40.16 v56.99,40.16
BUS_FX_A  (via drill 0.33)
  Top 0.254: IC11.3 v69.53,38.89 | IC11.6 77.79,36.67 v77.79,38.89 77.79,38.58 R75.2 | R81.1 58.1,28.73 | IC4.6 54.29,28.8 54.29,30.64 58.1,30.64 58.1,29.84 | v58.37,36.78 58.42,36.83 v58.42,38.89 | 58.1,29.84 58.1,28.73 | v58.74,35.08 60.01,33.81 60.01,33.34 60.48,32.86 60.48,29.69 59.53,28.73 58.1,28.73 | C26.1 58.1,29.84
  Bottom 0.254: v58.37,36.78 58.1,36.51 58.1,35.72 v58.74,35.08
  Bottom 0.508: v77.79,38.89 77.71,38.81 69.61,38.81 v69.53,38.89 69.45,38.81 58.5,38.81 v58.42,38.89
BUS_FX_B  (via drill 0.33)
  Top 0.254: IC11.14 v69.53,40.16 | v77.79,40.16 77.79,40.8 77.79,41.12 | 77.79,41.12 77.79,43.02 IC11.11 | R76.2 76.83,41.12 77.79,41.12 | R82.1 58.1,34.45 | 58.1,33.34 58.1,32.54 54.29,32.54 54.29,34.39 IC4.9 | 58.1,33.34 58.1,34.45 | 58.1,34.45 58.1,36.08 57.79,36.39 57.79,39.53 v58.42,40.16 | C27.1 58.1,33.34
  Bottom 0.508: v77.79,40.16 v69.53,40.16 v58.42,40.16
CON1
  Top 0.254: DA2.13 16.35,28.26 9.05,28.26 8.89,28.1 7.78,28.1 | IC3.6 6.98,27.3 7.78,27.3 7.78,28.1 | R44.2 7.78,28.1
CON2  (via drill 0.35)
  Top 0.254: IC3.2 6.34,19.53 6.51,19.37 v8.26,19.37 7.78,19.37 7.78,18.57 R41.2
  Bottom 0.254: DA2.4 16.03,20.95 9.68,20.95 8.26,19.53 v8.26,19.37
CON3  (via drill 0.35)
  Top 0.254: R43.2 30.8,27.62 30.96,27.46 v30.96,27.3 30.65,26.99 30.32,26.99 30.13,26.8 IC7.6
  Bottom 0.254: DA2.12 21.59,25.56 29.21,25.56 v30.96,27.3
CON4  (via drill 0.33)
  Top 0.254: R42.2 v31.43,18.73 31.4,18.76 31.43,18.79 31.43,19.37 31.12,19.69 30.32,19.69 30.13,19.87 IC7.9
  Bottom 0.254: DA2.5 21.43,18.1 30.8,18.1 v31.43,18.73
CON5  (via drill 0.33)
  Top 0.254: v58.26,27.15 58.28,27.13 58.13,26.99 IC2.2 | R48.2 v55.61,27.62
  Bottom 0.254: DA3.13 66.67,25.56 59.53,25.56 58.26,26.83 v58.26,27.15 57.79,27.62 v55.61,27.62
CON6  (via drill 0.33)
  Top 0.254: R45.2 v58.1,19.53 58.13,19.56 IC2.13
  Bottom 0.254: DA3.4 66.67,21.11 59.69,21.11 v58.1,19.53
CON_O1  (via drill 0.33)
  Top 0.254: IC2.6 55.56,26.19 55.56,26.83 55.24,27.15 v54.93,27.15 54.61,27.15 53.98,26.51 53.98,25.24 53.34,24.61 R52.2
  Bottom 0.254: DA1.12 46.67,25.88 53.66,25.88 v54.93,27.15
CV1  (via drill 0.33, 0.35)
  Top 0.254: R11.1 14.92,21.43 v13.65,20.16 | v14.6,14.76 15.24,14.13 15.87,14.13 17.46,12.54 U$3.7
  Bottom 0.254: v13.65,20.16 13.65,15.72 v14.6,14.76
CV2
  Top 0.254: R2.1 14.92,15.72 15.72,14.92 17.62,14.92 20,12.54 U$3.8
CV2_IN
  Top 0.254: R2.2 14.92,18.26 | 14.92,18.26 DA2.3 | R3.2 13.65,18.26 14.92,18.26
CV3
  Top 0.254: R8.1 22.54,21.59 21.27,20.32 21.27,13.27 22.54,12 U$3.9
CV4
  Top 0.254: U$3.10 22.54,13.81 R5.1
CV5  (via drill 0.33)
  Top 0.254: R23.1 65.72,21.43 v64.45,20.16 | U$2.11 70.88,11.35 v66.67,15.56
  Bottom 0.254: v66.67,15.56 64.45,17.78 v64.45,20.16
CV6
  Top 0.254: R14.1 67.95,15.85 68.74,15.06 69.56,15.06 U$2.12
CV6_IN
  Top 0.254: R14.2 67.95,18.26 66.67,18.26 | 66.67,18.26 65.72,19.21 DA3.3 | R15.2 66.67,18.26
CV_A_DRY  (via drill 0.33)
  Top 0.254: R35.1 40.32,21.43 39.05,20.16 v39.05,14.92
  Bottom 0.254: v39.05,14.92 39.05,12.54 U$3.15
CV_A_WET
  Top 0.254: U$2.4 50.96,13.34 49.21,13.34 46.67,15.88 46.67,22.52 R32.1
CV_B_DRY
  Top 0.254: R26.1 41.59,15.08 U$2.1
CV_B_WET
  Top 0.254: R29.1 47.47,15.88 49.21,14.13 52.7,14.13 U$2.5
CV_FX1
  Top 0.254: U$2.13 72.07,15.08 72.07,21.57 R20.1
CV_FX2
  Top 0.254: R17.1 73.34,15.88 76.52,12.7 76.99,12.7 U$2.14
CV_O2
  Top 0.254: R27.2 40.32,18.28 | 40.32,18.28 DA1.3 | R26.2 41.59,17.8 41.12,18.28 40.32,18.28
DGND  (via drill 0.33)
  Top 0.254: v35.8,33.52 | IC1.21 35.84,33.56 v35.8,33.52 | v41.12,29.84 41.04,29.77 IC1.12 | v33.18,34.77 28.42,34.77 28.42,33.97 | C23.1 28.42,33.97 | 3.18,32.23 4.92,33.97 9.52,33.97 9.84,34.29 | 3.18,32.23 1.44,30.49 1.44,16.02 1.43,16.02 v1.43,14.61 | 26.35,32.07 26.99,32.07 27.3,31.75 31.43,31.75 32.48,32.8 35.08,32.8 v35.8,33.52 | 26.35,32.07 19.84,32.07 | 19.84,32.07 15.87,32.07 | 15.87,32.07 8.89,32.07 | 8.89,32.07 5.72,32.07 4.29,30.64 4.29,16.83 7.94,13.18 U$3.4 | 9.84,34.29 14.92,34.29 | 19.84,33.97 26.35,33.97 | 26.35,33.97 28.42,33.97 | IC1.2 34.54,28.03 34.29,27.78 33.5,27.78 33.34,27.94 v33.34,28.42 | v9.84,34.45 9.84,34.29 | v14.92,34.45 14.92,34.29 | v15.87,31.91 15.87,32.07 | v8.89,31.91 8.89,32.07 | v2.86,32.7 3.18,32.38 3.18,32.23 | v19.84,34.45 19.84,33.97 | v26.35,34.45 26.35,33.97 | v26.35,31.91 26.35,32.07 | v19.84,31.91 19.84,32.07 | 14.92,34.29 15.24,33.97 19.84,33.97
  Bottom 0.254: v35.8,33.52 35.8,31.75 | 35.88,29.53 35.88,31.75 35.8,31.75 | v41.12,29.84 40.8,29.53 35.88,29.53 | v33.18,34.77 33.18,32.54 33.97,31.75 35.8,31.75 | 35.88,29.53 34.45,29.53 v33.34,28.42
  pour Bottom: 32.7,34.77 32.86,34.93 41.27,34.93 42.55,33.66 42.55,29.69 41.12,28.26 33.34,28.26 32.7,28.89
  pour Bottom: 10,12.38 4.92,17.46 4.92,28.58 6.35,30 6.35,34.45 6.19,34.61 -0.63,34.61 -0.63,7.62 10,7.62
  pour Bottom: 8.26,34.61 8.1,34.45 8.1,30.16 8.26,30 16.51,30 16.67,30.16 16.67,34.45 16.51,34.61
  pour Bottom: 18.26,34.45 18.26,30.16 19.37,29.05 26.35,29.05 26.83,29.53 26.83,34.45 26.67,34.61 18.41,34.61
DIG_1_BUS_A  (via drill 0.33)
  Top 0.254: IC1.4 35.88,28.71 35.88,29.69 35.56,30 33.5,30 32.39,28.89 21.59,28.89 19.84,30.64 5.4,30.64 v5.24,30.8 | IC8.1 v3.49,34.45
  Bottom 0.254: v3.49,34.45 3.49,32.54 v5.24,30.8
DIG_1_BUS_B  (via drill 0.33)
  Top 0.254: IC1.5 36.49,29.87 35.88,30.48 33.34,30.48 32.23,29.37 22.23,29.37 20.32,31.27 v5.72,31.27 | IC8.16 3.49,37.78 4.76,36.51 v4.76,34.61
  Bottom 0.254: v5.72,31.27 4.76,32.23 v4.76,34.61
DIG_2_BUS_A  (via drill 0.33)
  Top 0.254: IC1.6 37.14,30.49 36.67,30.96 33.18,30.96 32.07,29.84 22.86,29.84 v21.27,31.43 | v21.27,34.61 IC8.8
  Bottom 0.254: v21.27,31.43 v21.27,34.61
DIG_2_BUS_B  (via drill 0.33)
  Top 0.254: IC1.7 37.79,30.63 36.99,31.43 33.02,31.43 31.91,30.32 23.65,30.32 v22.54,31.43 | v22.54,34.61 22.54,42.39 IC8.9
  Bottom 0.254: v22.54,31.43 v22.54,34.61
DIG_3_BUS_A  (via drill 0.33)
  Top 0.254: IC1.17 38.44,33.04 37.31,31.91 32.86,31.91 31.75,30.8 24.45,30.8 v23.81,31.43 | v23.81,34.61 IC9.1
  Bottom 0.254: v23.81,31.43 v23.81,34.61
DIG_3_BUS_B  (via drill 0.33)
  Top 0.254: IC1.18 37.79,33.03 37.15,32.38 32.7,32.38 31.59,31.27 25.24,31.27 v25.08,31.43 | IC9.16 23.81,37.62 25.08,36.35 v25.08,34.61
  Bottom 0.254: v25.08,31.43 v25.08,34.61
DIG_4_BUS_A  (via drill 0.33)
  Top 0.254: IC1.19 37.15,33.5 v37.2,33.5
  Bottom 0.254: v37.2,33.5 38.24,33.5 40.78,36.04 IC9.8
DIG_4_BUS_B  (via drill 0.33)
  Top 0.254: IC1.20 36.51,34.49 v36.51,33.5 | v42.39,35.08 42.7,35.4 42.7,36.99 41.59,38.1 IC9.9
  Bottom 0.254: v36.51,33.5 36.51,33.18 36.83,32.86 38.26,32.86 40.32,34.93 42.23,34.93 v42.39,35.08
DIG_5_BUS_A  (via drill 0.33)
  Top 0.254: IC1.15 39.74,32.97 v39.85,32.86
  Bottom 0.254: v39.85,32.86 40.96,33.97 42.86,33.97 44.13,35.24 IC10.1
DIG_5_BUS_B  (via drill 0.33)
  Top 0.254: IC1.16 39.09,32.9 v39.05,32.86 | IC10.16 44.13,37.7 v43.34,36.91
  Bottom 0.254: v43.34,36.91 43.02,36.59 43.02,34.93 42.55,34.45 40.64,34.45 v39.05,32.86
DIG_6_BUS_A  (via drill 0.33)
  Top 0.254: IC1.13 41.04,33.57 v41.27,33.34 | v61.28,33.66 61.91,34.29 IC10.8
  Bottom 0.254: v41.27,33.34 41.43,33.18 56.36,33.18 56.67,33.5 61.12,33.5 v61.28,33.66
DIG_6_BUS_B  (via drill 0.33)
  Top 0.254: IC1.14 40.39,33.27 v40.8,32.86 | v61.75,33.18 63.02,34.45 63.02,42.55 IC10.9
  Bottom 0.254: v40.8,32.86 40.96,32.7 56.51,32.7 56.83,33.02 61.59,33.02 v61.75,33.18
DIG_7_BUS_A  (via drill 0.33)
  Top 0.254: IC1.8 38.42,28.7 38.42,30.96 v39.21,31.75 | v62.23,32.7 64.45,34.93 IC11.1
  Bottom 0.254: v39.21,31.75 39.69,32.23 56.83,32.23 57.15,32.54 62.07,32.54 v62.23,32.7
DIG_7_BUS_B  (via drill 0.33)
  Top 0.254: IC1.9 39.05,28.71 39.05,30.64 v39.69,31.27 | v62.71,32.23 65.72,35.24 65.72,36.35 64.45,37.62 IC11.16
  Bottom 0.254: v62.71,32.23 62.55,32.07 57.31,32.07 56.99,31.75 40.16,31.75 v39.69,31.27
DIG_8_BUS_A  (via drill 0.33)
  Top 0.254: IC1.10 39.74,30.37 v40.16,30.8 | v80.01,33.02 82.23,35.24 IC11.8
  Bottom 0.254: v80.01,33.02 78.58,31.59 57.47,31.59 57.15,31.27 40.64,31.27 v40.16,30.8
DIG_8_BUS_B  (via drill 0.33)
  Top 0.254: IC1.11 40.39,30.07 v40.64,30.32 | v80.07,32.07 79.44,32.7 79.44,33.5 81.03,35.08 81.03,36.51 82.23,37.72 IC11.9
  Bottom 0.254: v80.07,32.07 79.12,31.12 57.53,31.12 57.21,30.8 41.11,30.79 v40.64,30.32
GND  (via drill 0.33)
  Top 0.254: R6.1 v23.81,15.72 | R30.1 v48.58,15.72 | IC4.12 52.37,35.07 v53.02,35.72 53.67,35.07 IC4.10 | IC4.3 52.37,28.08 v51.75,27.46 | IC4.5 53.67,28.24 v54.29,27.62 | R36.1 v39.05,21.11
  Top 0.508: C2.2 26.99,21.75 27.62,21.11 DA2.8 | DA3.8 78.42,21.11 77.77,21.76 77.77,22.67 C4.2 | C6.2 52.07,21.75 53.02,20.8 DA1.8
  Bottom 0.61: 26.99,23.02 8.26,23.02
  other vias: 6.19,37.78 6.03,42.07 14.45,40.84 14.45,39.49 14.45,38.14 21.27,40.84 21.27,39.49 21.27,38.14 24.45,40.84 24.45,39.49 24.45,38.14 28.26,40.84 28.26,39.49 28.26,38.14 31.43,40.84 31.43,39.49 31.43,38.14 36.2,40.84 35.24,36.67 30.16,36.67 14.92,36.67 10,37.62 53.5,40.84 53.5,39.49 53.5,38.14 50.48,36.67 62.23,40.84 62.23,39.49 62.23,38.14 68.9,40.84 70.17,38.14 70.33,40.84 74.14,38.14 74.14,39.49 74.14,40.84 81.6,40.96 82.87,40.96 82.87,38.42 81.6,38.42 78.42,30.16 76.36,32.7 70.01,33.18 69.53,28.42 74.45,29.53 65.41,33.18 64.61,29.05 61.75,29.05 6.19,23.81 14.29,15.88 20.64,13.34 16.19,12.7 25.08,12.7 27.62,12.7 22.7,12.7 30.48,16.19 45.56,12.86 51.91,13.34 79.69,13.81 82.23,32.07 37.78,38.14 37.78,36.67 79.22,34.45 79.38,37.15 56.83,23.34 60.48,23.34 60.8,13.34 64.45,13.02 66.99,13.34 16.03,23.02 18.73,23.02 21.27,23.02 23.81,20.64 18.73,20.64 36.35,25.64 42.86,21.11 41.59,22.94 50.01,21.11 45.09,21.11 66.99,19.05 69.53,21.11 69.53,23.34 72.71,18.26 75.25,18.26 32.23,23.18 10.4,23.34 8.41,17.94 8.73,26.04 13.02,25.56 13.02,18.41 23.81,27.15 21.27,27.15 26.35,27.15 33.97,16.19 35.88,13.02 59.05,13.02 69.37,13.65 13.81,12.7 58.74,29.37 51.59,15.56 77.15,13.26
  pour Bottom: -1.43,45.09 88.11,45.24 88.11,45.09 88.11,7.62 13.02,7.62 13.02,12.07 11.91,13.18 11.43,13.18 7.14,17.46 6.51,17.46 5.71,18.26 5.71,28.1 6.83,29.21 18.26,29.21 19.21,28.26 32.23,28.26 33.5,26.99 40.96,26.99 43.97,30 63.18,30 63.66,30.48 63.66,32.38 61.59,34.45 60.33,34.45 59.85,33.97 45.72,33.97 45.24,34.45 45.24,36.51 40.16,36.51 39.69,36.04 -1.43,36.04
  pour Top: 1.59,45.4 86.52,45.4 86.52,7.14 13.02,7.14 13.02,12.07 11.91,13.18 11.43,13.18 7.14,17.46 6.51,17.46 5.71,18.26 5.71,28.1 6.83,29.21 18.41,29.21 20,27.62 32.86,27.62 33.5,26.99 40.96,26.99 43.97,30 43.97,34.93 42.39,36.51 40.16,36.51 39.69,36.04 -1.11,36.04 -1.11,44.77 1.59,47.47
IN1  (via drill 0.33, 0.35)
  Top 0.254: R13.1 12.38,21.43 v11.11,20.16 | U$3.5 12.38,13.81 v12.07,14.13
  Bottom 0.254: v11.11,20.16 11.11,15.08 v12.07,14.13
IN2
  Top 0.254: R4.1 12.38,15.72 14.92,13.18 U$3.6
IN3  (via drill 0.33)
  Top 0.254: v27.78,16.35 26.35,17.78 26.35,20.48 25.08,21.75 R10.1
  Bottom 0.254: v27.78,16.35 28.89,15.24 28.89,12.54 U$3.11
IN4
  Top 0.254: R7.1 25.08,15.85 25.69,15.24 27.46,15.24 30.16,12.54 U$3.12
IN5  (via drill 0.33)
  Top 0.254: R25.1 63.18,21.43 v61.91,20.16 | U$2.9 65.41,11.27 61.91,14.76 v61.91,14.92
  Bottom 0.254: v61.91,14.92 v61.91,20.16
IN6
  Top 0.254: U$2.10 66.83,12.7 66.04,12.7 64.93,13.81 | R70.1 64.93,13.81 | 64.93,13.81 63.98,13.81 63.18,14.61 R16.1
IN_FX1  (via drill 0.33)
  Top 0.254: v74.61,20.16 75.88,21.43 R22.1 | U$2.15 78.26,13.97 76.2,13.97 v75.41,14.76
  Bottom 0.254: v74.61,20.16 74.61,15.56 v75.41,14.76
IN_FX2
  Top 0.254: R19.1 75.88,15.88 76.52,15.24 79.53,15.24 U$2.16
IN_O1
  Top 0.254: DA1.15 R37.2
IN_O2
  Top 0.254: R28.2 DA1.2
IN_O3
  Top 0.254: R34.2 49.05,25.72 DA1.10
IN_O4
  Top 0.254: R31.2 DA1.7
N$1
  Top 0.254: R39.2 DA3.1
N$2
  Top 0.254: R38.2 DA2.1
N$3
  Top 0.254: R17.2 73.34,18.26 | 73.34,18.26 DA3.6 | R18.2 74.61,18.26 73.34,18.26
N$4  (via drill 0.33)
  Top 0.254: v81.92,21.43 IC6.3 81.92,19.53 82.25,19.21 82.55,19.21 82.71,19.05 82.71,18.57 82.55,18.41 R46.1
  Bottom 0.254: DA3.5 72.39,21.11 79.06,21.11 79.85,20.32 80.8,20.32 v81.92,21.43
N$5
  Top 0.254: R20.2 73.34,25.88 | 73.34,25.88 DA3.11 | R21.2 74.61,25.88 73.34,25.88
N$6  (via drill 0.33)
  Top 0.254: R50.2 55.53,17.52 v55.53,19.53 IC2.9 | R69.1 45.4,18.26 | 45.4,18.26 DA1.5 | R71.1 42.98,15.92 43.18,15.72 43.81,15.72 44.65,16.55 44.65,17.98 44.93,18.26 45.4,18.26
  Bottom 0.254: DA1.5 46.67,18.26 54.26,18.26 v55.53,19.53
N$7
  Top 0.254: R23.2 65.72,25.88 | 65.72,25.88 DA3.14 | R24.2 64.45,25.88 65.72,25.88
N$8
  Top 0.254: R39.1 60.64,15.72 61.91,15.72 C14.2
N$9
  Top 0.254: DA1.1 R40.2
N$10
  Top 0.254: R5.2 22.54,18.26 | 22.54,18.26 DA2.6 | R6.2 23.81,18.26 22.54,18.26
N$11
  Top 0.254: R29.2 47.47,18.26 47.94,18.26 | 47.94,18.26 DA1.6 | R30.2 48.58,18.26 47.94,18.26
N$12
  Top 0.254: R8.2 22.54,25.88 | 22.54,25.88 DA2.11 | R9.2 23.81,25.88 22.54,25.88
N$13
  Top 0.254: R32.2 46.36,25.56 46.67,25.88 47.47,25.88 | DA1.11 47.94,26.19 47.62,25.88 47.47,25.88 | 47.47,25.88 R33.2
N$14
  Top 0.254: R38.1 9.84,15.72 11.11,15.72 C13.2
N$15
  Top 0.254: R35.2 40.32,25.88 | 40.32,25.88 DA1.14 | R36.2 39.05,25.88 40.32,25.88
N$16
  Top 0.254: R40.1 35.24,15.72 36.51,15.72 C15.2
N$17  (via drill 0.33)
  Top 0.254: R51.2 32.39,18.87 32.39,19.37 32.7,19.69 32.7,20.48 IC7.13 32.73,21.62 33.18,22.07 v34.29,22.07
  Bottom 0.254: v34.29,22.07 34.61,21.75 40.16,21.75 42.39,19.53 DA1.4
N$18  (via drill 0.33)
  Top 0.254: v56.2,25.24 56.18,25.26 IC2.5 | R49.1 DA1.13
  Bottom 0.254: DA1.13 44.77,25.24 v56.2,25.24
N$19  (via drill 0.33)
  Top 0.254: IC6.5 82.55,26.28 82.55,28.42 | 82.55,28.42 R47.1 | DA3.12 72.07,28.42 v77.95,28.42 | v79.37,29.37 82.23,29.37 82.55,29.05 82.55,28.42
  Bottom 0.254: v79.37,29.37 78.42,28.42 v77.95,28.42
N$20  (via drill 0.33)
  Top 0.254: R51.1 33.66,18.87 33.66,19.53 33.38,19.8 IC7.14 33.38,21.32 33.5,21.43 34.29,21.43 v34.61,21.11 | R71.2 42.98,17.96 42.69,18.26 v42.23,18.26
  Bottom 0.254: v42.23,18.26 39.85,18.26 39.05,19.05 39.05,20.16 38.1,21.11 v34.61,21.11
N$21
  Top 0.254: R11.2 14.92,25.88 | 14.92,25.88 DA2.14 | R12.2 13.65,25.88 14.92,25.88
N$22
  Top 0.254: IC7.2 IC7.1
OUT1  (via drill 0.33)
  Top 0.254: IC3.7 v6.35,27.3 5.56,27.3 5.56,28.1 R44.1 | R59.1 7.3,38.89 | R60.1 7.3,40.8 7.3,38.89 | 7.3,38.89 v7.3,35.4
  Bottom 0.254: v7.3,35.4 7.3,28.26 v6.35,27.3
OUT2  (via drill 0.33)
  Top 0.254: R54.1 17.46,40.8 17.46,38.89 | 17.46,38.89 R53.1 | v17.46,28.73 v8.41,28.73 | v17.46,35.4 17.46,38.89 | R41.1 5.56,18.57 5.56,19.37 5.69,19.5 IC3.1 5.69,22.2 v7.46,23.97
  Bottom 0.254: v8.41,28.73 8.41,28.1 7.62,27.3 7.62,24.13 v7.46,23.97 | v17.46,28.73 v17.46,35.4
OUT3  (via drill 0.33)
  Top 0.254: R58.1 27.62,40.8 27.62,38.89 | 27.62,38.89 R57.1 | v27.62,35.4 27.62,38.89 | R43.1 28.89,27.33 v28.89,26.83 29.37,26.83 29.48,26.72 IC7.7
  Bottom 0.254: v28.89,26.83 28.89,31.43 27.62,32.7 v27.62,35.4
OUT4  (via drill 0.33)
  Top 0.254: R55.1 37.78,38.89 37.78,39.53 | R56.1 37.78,40.8 37.78,39.53 | v32.7,25.08 29.48,21.86 IC7.8 29.48,19.96 29.21,19.69 28.89,19.69 28.73,19.53 28.73,19.05 29.05,18.73 R42.1 | v32.7,35.56 32.7,36.35 33.97,37.62 35.88,37.62 36.19,37.94 36.19,39.53 37.78,39.53
  Bottom 0.254: v32.7,35.56 32.07,34.93 32.07,28.73 32.7,28.1 v32.7,25.08
OUT5  (via drill 0.33)
  Top 0.254: R68.1 45.4,40.8 45.4,38.89 | R67.1 45.4,38.89 | 45.4,38.89 v45.4,30 | IC2.1 58.78,27.74 v58.42,28.1 57.94,27.62 R48.1
  Bottom 0.254: v45.4,30 56.51,30 v58.42,28.1
OUT6  (via drill 0.33)
  Top 0.254: R61.1 61.62,38.89 | R62.1 61.59,40.8 61.62,40.78 61.62,38.89 | 61.62,38.89 61.62,37.65 60.64,36.67 60.64,33.34 61.28,32.7 61.28,29.53 59.37,27.62 59.37,23.81 58.78,23.22 IC2.14 58.78,18.7 v58.66,18.57 | v58.1,15.72 R45.1
  Bottom 0.254: v58.66,18.57 58.66,16.27 v58.1,15.72
OUT7
  Top 0.254: R65.1 68.26,38.89 68.26,39.53 | 68.26,39.53 68.26,40.8 R66.1 | 68.26,39.53 69.85,39.53 70.8,38.58 70.8,35.56 76.99,29.37 78.11,29.37 80.17,27.3 81.28,27.3 | 81.28,27.3 81.76,27.3 81.92,27.14 IC6.6 | 81.28,27.3 IC6.7
OUT8  (via drill 0.33)
  Top 0.254: R63.1 78.42,38.89 | 78.42,38.89 78.42,40.8 R64.1 | 78.42,38.89 78.42,32.54 80.8,30.16 v82.55,30.16 | IC6.1 80.62,21.41 v80.64,21.43 80.8,21.59 81.12,21.59 81.28,21.43 IC6.2
  Bottom 0.254: v82.55,30.16 82.55,23.97 80.64,22.07 v80.64,21.43
OUT_A  (via drill 0.33)
  Top 0.254: U$2.2 46.2,13.02 v46.2,14.76 | IC2.7 54.88,23.61 54.29,23.02 54.29,22.07 | v54.29,15.08 54.29,22.07 | R52.1 53.34,22.38 53.66,22.07 54.29,22.07
  Bottom 0.254: v54.29,15.08 53.98,14.76 v46.2,14.76
OUT_B  (via drill 0.33)
  Top 0.254: U$2.3 50.32,11.27 v47.78,13.81 | IC2.8 54.88,15.4 | 54.88,15.4 54.88,14.33 v54.93,14.29 | R50.1 55.56,15.72 55.24,15.4 54.88,15.4
  Bottom 0.254: v47.78,13.81 47.94,13.97 54.61,13.97 v54.93,14.29
SCL
  Top 0.254: IC1.22 35.19,33.76 34.61,33.18 32.23,33.18 31.27,32.23 27.62,32.23 27.3,32.54 5.4,32.54 3.49,30.64 3.49,16.35 7.3,12.54 U$3.3
SDA
  Top 0.254: IC1.23 34.54,33.75 34.45,33.66 32.07,33.66 31.12,32.7 27.94,32.7 27.62,33.02 5.24,33.02 2.86,30.64 2.86,14.61 4.76,12.7 U$3.2
SUM1
  Top 0.254: R13.2 DA2.15
SUM2
  Top 0.254: R4.2 DA2.2
SUM3
  Top 0.254: R10.2 DA2.10
SUM4
  Top 0.254: R7.2 DA2.7
SUM5
  Top 0.254: R25.2 DA3.15
SUM6
  Top 0.254: R16.2 63.18,18.41 | 63.18,18.41 DA3.2 | R70.2 64.93,17.94 64.45,18.41 63.18,18.41
SUM7
  Top 0.254: R22.2 DA3.10
SUM8
  Top 0.254: R19.2 DA3.7
SUM_A  (via drill 0.33)
  Top 0.254: 50.48,28.73 51.04,28.73 IC4.1 | 50.48,28.73 v50.48,28.89 50.48,29.84 C24.2 | 50.48,28.73 R79.2 | v36.51,23.81 36.51,22.07 | 36.51,22.07 37.78,22.07 R37.1 | v43.66,28.89 42.86,28.89 41.59,27.62 v41.59,23.81 | v36.51,20.16 36.51,22.07 | v36.51,15.08 U$3.13
  Bottom 0.254: v43.66,28.89 v50.48,28.89 | v41.59,23.81 v36.51,23.81 | v36.51,15.08 v36.51,20.16
SUM_B  (via drill 0.33)
  Top 0.254: 50.48,34.45 R80.2 | 50.48,34.45 51.04,34.45 IC4.14 | 50.48,34.45 v50.48,35.08 | R28.1 v37.78,15.72 37.78,13.81 U$3.14 | v46.04,34.13 46.04,29.69 44.13,27.78 v44.13,18.73 | C25.2 50.48,33.34 50.48,34.45
  Bottom 0.254: v50.48,35.08 49.85,34.45 46.36,34.45 v46.04,34.13 | v44.13,18.73 44.13,18.57 41.27,15.72 v37.78,15.72
SUM_FX_A  (via drill 0.33)
  Top 0.254: IC4.7 55.01,28.73 v55.56,28.73 | v55.56,28.73 R81.2 | v49.21,27.78 49.21,26.62 48.26,25.67 48.26,22.38 48.58,22.07 48.9,22.07 49.05,22.23 R34.1 | v55.56,28.73 55.56,29.84 C26.2
  Bottom 0.254: v49.21,27.78 49.69,28.26 55.09,28.26 v55.56,28.73
SUM_FX_B  (via drill 0.33)
  Top 0.254: IC4.8 55.01,34.45 v55.56,34.45 | v55.56,34.45 R82.2 | v46.04,20.95 45.4,21.59 45.4,25.4 46.67,26.67 v46.67,33.81 | R31.1 50.48,15.56 49.37,15.56 49.37,18.73 49.21,18.89 v49.21,20.8 | v55.56,34.45 55.56,33.34 C27.2
  Bottom 0.254: v55.56,34.45 50.96,34.45 50.32,33.81 v46.67,33.81 | v49.21,20.8 46.2,20.8 v46.04,20.95
SVF_CHAIN  (via drill 0.33)
  Top 0.254: R69.2 45.4,15.85 43.84,14.29 v43.81,14.29
  Bottom 0.254: U$3.16 40.8,11.27 v43.81,14.29
SW1A
  Top 0.254: R59.2 4.6,38.89 4.6,38.1 6.03,36.67 IC8.2
SW1B
  Top 0.254: IC8.15 4.6,42.23 4.6,40.8 R60.2
SW2A
  Top 0.254: R53.2 20,38.89 20,37.31 IC8.7
SW2B
  Top 0.254: R54.2 20,40.8 20,42.39 IC8.10
SW3A
  Top 0.254: R57.2 25.08,38.89 25.08,37.31 IC9.2
SW3B
  Top 0.254: R58.2 25.08,40.8 25.08,42.39 IC9.15
SW4A
  Top 0.254: R55.2 40.32,38.89 40.32,37.31 IC9.7
SW4B
  Top 0.254: R56.2 40.32,40.8 40.32,42.39 IC9.10
SW5A
  Top 0.254: IC10.2 47.94,37.31 47.94,38.89 R67.2
SW5B
  Top 0.254: R68.2 47.94,40.8 47.94,42.39 IC10.15
SW6A
  Top 0.254: IC10.7 59.37,37.62 59.05,37.94 59.05,38.89 R61.2
SW6B
  Top 0.254: R62.2 59.05,40.8 59.05,42.7 59.37,43.02 IC10.10
SW7A
  Top 0.254: R65.2 65.72,38.89 65.72,37.31 IC11.2
SW7B
  Top 0.254: R66.2 65.72,40.8 65.72,42.39 IC11.15
SW8A
  Top 0.254: R63.2 80.96,38.89 80.96,37.31 IC11.7
SW8B
  Top 0.254: R64.2 80.96,40.8 80.96,42.39 IC11.10
VL
  Top 0.254: IC9.12 33.97,41.12 | 33.97,41.12 R78.1 | 33.97,41.12 34.61,41.12 34.61,38.58 35.24,38.58 R77.2
  Bottom 0.254: IC8.12 13.65,42.39 33.97,42.39 | IC11.12 74.61,42.39 54.29,42.39 | 33.97,42.39 54.29,42.39 | IC10.12 54.29,42.39 | IC9.12 33.97,42.39

### Text on the board
tNames: Pre-filter bus mixer / DG412 version v1.4 | 4VOB
bNames: +3V3 | SDA | SCL | DGND | In 1 | In 2 | CV 1 | CV 2 | CV 3 | CV 4 | In 3 | In 4 | SUM A | SUM B | CV A | CHAIN | CV B | OUT A | OUT B | CV FX A | CV FX B | +12V | AGND | -12V | In 5 | In 6 | CV 5 | CV 6 | CV FX 1 | CV FX 2 | In FX 1 | In FX 2